# Altium schematic sheet ai.SchDoc
size A4; SheetNumber: 3; SheetTotal: 3
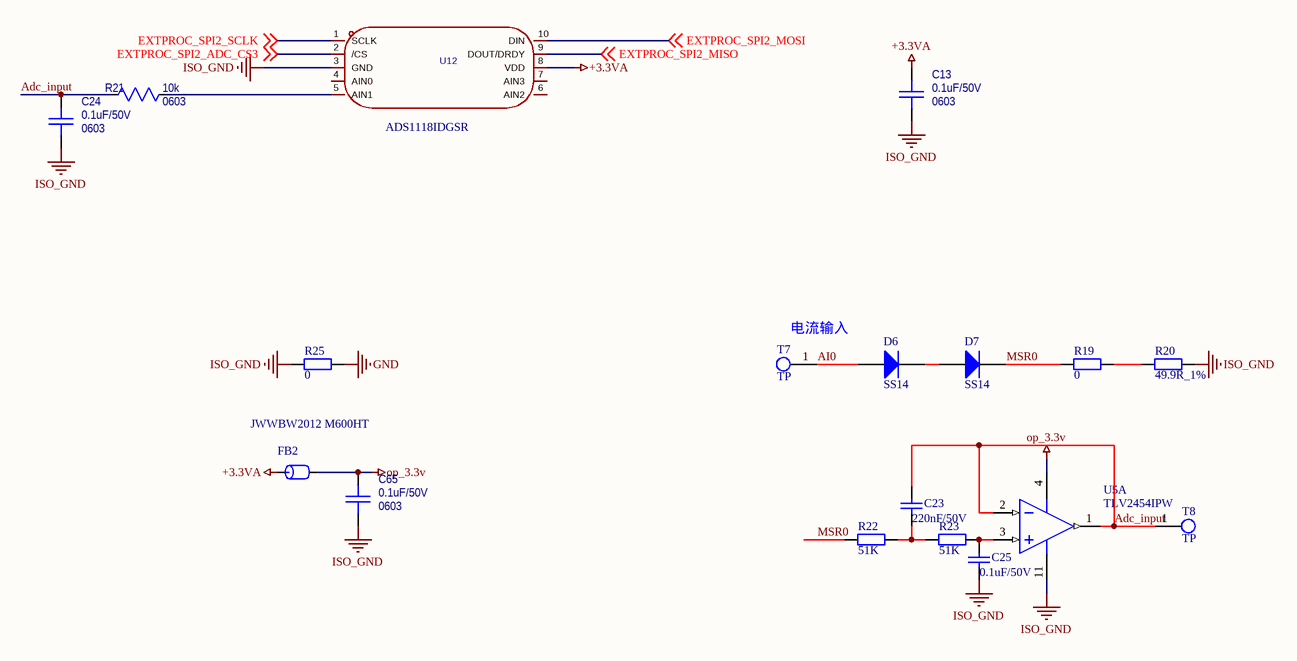
[diagram p0: ai.SchDoc]

## Parts
C13  Package: 0603  [0603C]  (hidden comment: 0.1uF/50V)
C23  220nF/50V  [0603C]
C24  Package: 0603  [0603C]  (hidden comment: 0.1uF/50V)
C25  0.1uF/50V  [0603C]
C65  Package: 0603  [0603C]  (hidden comment: 0.1uF/50V)
D6  SS14  [DO-214AC]
D7  SS14  [DO-214AC]
FB2  JWWBW2012 M600HT  [0805R]
R19  0  [0603R]
R20  49.9R_1%  [0603R]
R21  value 10k  Package: 0603  [0603R]  (hidden comment: 10K/1%)
R22  51K  [0603R]
R23  51K  [0603R]
R25  0  [0603R]
T7  TP  [TPD]
T8  TP  [TPD]
U5  TLV2454IPW  [TSSOP14]  (part A of 4)
U12  ADS1118IDGSR  [VSSOP-10_L3.0-W3.0-P0.50-LS4.9-BL]

## Nets
+3.3VA: C13.1 FB2.1 U12.8(VDD)
GND: R25.1
ISO_GND: C13.2 C24.2 C25.1 C65.2 R20.1 R25.2 U5.11(GND) U12.3(GND)
op_3.3v: C65.1 FB2.2 U5.4(V+)
Adc_input: C23.2 C24.1 R21.2 T8.1 U5.1(OUT) U5.2(IN-)
AI0: D6.1(A) T7.1
EXTPROC_SPI2_ADC_CS3: U12.2(/CS) ; off-sheet EXTPROC_SPI2_ADC_CS3
EXTPROC_SPI2_MISO: U12.9(DOUT/DRDY) ; off-sheet EXTPROC_SPI2_MISO
EXTPROC_SPI2_MOSI: U12.10(DIN) ; off-sheet EXTPROC_SPI2_MOSI
EXTPROC_SPI2_SCLK: U12.1(SCLK) ; off-sheet EXTPROC_SPI2_SCLK
MSR0: D7.2(K) R19.2 R22.2
NetC23_1: C23.1 R22.1 R23.2
NetC25_2: C25.2 R23.1 U5.3(IN+)
NetD6_2: D6.2(K) D7.1(A)
NetR19_1: R19.1 R20.2
NetR21_1: R21.1 U12.5(AIN1)

Not connected (* = marked no-connect by the designer): U12 4(AIN0) 6(AIN2) 7(AIN3)

## Notes on the sheet
- (near T7) 电流输入

## Library data of the parts
C13 C24 C65 = Capacitor_0603: Capacitor, MLCC; Voltage Rating: [voltage]; Value: 0.1uF/50V
C23 C25 = Cap: Capacitor; Package: 0603
  C25: Value: 0.1uF/50V
D6 D7 = Diode: Default Diode; Package: DO-214AC
FB2 = FB: Package: 0805R
R19 R20 R22 R23 R25 = Res0805M: Package: 0603
R21 = Resistor_0603: Resistor, Standard
U5 = MAX908EPD: Quad High-speed, Ultra Low-power, Single-Supply TTL comparator; Package: TSSOP14
U12 = ADS1118IDGSR_C55347: Package: VSSOP-10_L3.0-W3.0-P0.50-LS4.9-BL
T7 T8 = TP: Package: TPD